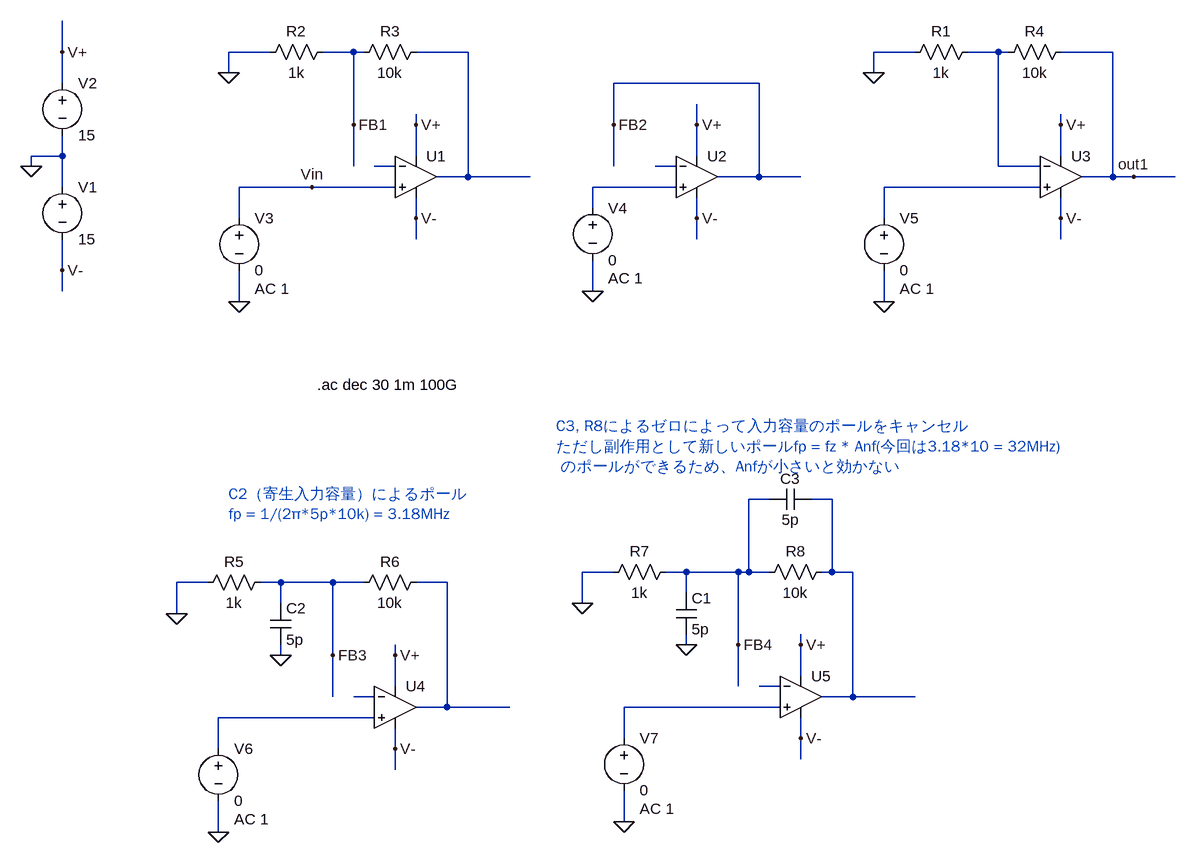
[diagram p0: schematic NonInvAmp.asc]
NonInvAmp.asc, the LTspice schematic file:
Version 4
SHEET 1 1684 1236
WIRE -96 16 -96 -32
WIRE 224 16 160 16
WIRE 352 16 304 16
WIRE 368 16 352 16
WIRE 528 16 448 16
WIRE 1216 16 1152 16
WIRE 1344 16 1296 16
WIRE 1360 16 1344 16
WIRE 1520 16 1440 16
WIRE 160 48 160 16
WIRE 1152 48 1152 16
WIRE -96 64 -96 16
WIRE 976 64 752 64
WIRE 352 128 352 16
WIRE 448 128 448 112
WIRE 752 128 752 64
WIRE 880 128 880 96
WIRE 1440 128 1440 112
WIRE -96 176 -96 144
WIRE -96 176 -144 176
WIRE 448 176 448 128
WIRE 880 176 880 128
WIRE 1440 176 1440 128
WIRE -144 192 -144 176
WIRE 352 192 352 128
WIRE 416 192 384 192
WIRE 752 192 752 128
WIRE 848 192 816 192
WIRE 1344 192 1344 16
WIRE 1408 192 1344 192
WIRE 528 208 528 16
WIRE 528 208 480 208
WIRE 624 208 528 208
WIRE 976 208 976 64
WIRE 976 208 912 208
WIRE 1040 208 976 208
WIRE 1520 208 1520 16
WIRE 1520 208 1472 208
WIRE 1552 208 1520 208
WIRE 1616 208 1552 208
WIRE -96 224 -96 176
WIRE 288 224 176 224
WIRE 416 224 288 224
WIRE 848 224 720 224
WIRE 1408 224 1168 224
WIRE 720 256 720 224
WIRE 176 272 176 224
WIRE 448 272 448 240
WIRE 880 272 880 240
WIRE 1168 272 1168 224
WIRE 1440 272 1440 240
WIRE 448 304 448 272
WIRE 880 304 880 272
WIRE 1440 304 1440 272
WIRE -96 352 -96 304
WIRE -96 384 -96 352
WIRE 720 384 720 336
WIRE 176 400 176 352
WIRE 1168 400 1168 352
WIRE 992 704 960 704
WIRE 1088 704 1056 704
WIRE 752 816 704 816
WIRE 864 816 832 816
WIRE 944 816 864 816
WIRE 960 816 960 704
WIRE 960 816 944 816
WIRE 992 816 960 816
WIRE 1088 816 1088 704
WIRE 1088 816 1072 816
WIRE 1120 816 1088 816
WIRE 128 832 80 832
WIRE 240 832 208 832
WIRE 320 832 240 832
WIRE 368 832 320 832
WIRE 496 832 448 832
WIRE 864 848 864 816
WIRE 240 864 240 832
WIRE 704 864 704 816
WIRE 80 880 80 832
WIRE 864 928 864 912
WIRE 944 928 944 816
WIRE 1040 928 1040 912
WIRE 240 944 240 928
WIRE 320 944 320 832
WIRE 416 944 416 928
WIRE 1040 976 1040 928
WIRE 416 992 416 944
WIRE 944 992 944 928
WIRE 1008 992 976 992
WIRE 320 1008 320 944
WIRE 384 1008 352 1008
WIRE 1120 1008 1120 816
WIRE 1120 1008 1072 1008
WIRE 1216 1008 1120 1008
WIRE 496 1024 496 832
WIRE 496 1024 448 1024
WIRE 592 1024 496 1024
WIRE 1008 1024 768 1024
WIRE 384 1040 144 1040
WIRE 768 1072 768 1024
WIRE 1040 1072 1040 1040
WIRE 144 1088 144 1040
WIRE 416 1088 416 1056
WIRE 1040 1104 1040 1072
WIRE 416 1120 416 1088
WIRE 768 1200 768 1152
WIRE 144 1216 144 1168
FLAG 176 400 0
FLAG -144 192 0
FLAG -96 16 V+
FLAG -96 352 V-
FLAG 448 128 V+
FLAG 448 272 V-
FLAG 160 48 0
FLAG 288 224 Vin
FLAG 720 384 0
FLAG 880 128 V+
FLAG 880 272 V-
FLAG 352 128 FB1
FLAG 752 128 FB2
FLAG 1168 400 0
FLAG 1440 128 V+
FLAG 1440 272 V-
FLAG 1152 48 0
FLAG 1552 208 out1
FLAG 144 1216 0
FLAG 416 944 V+
FLAG 416 1088 V-
FLAG 80 880 0
FLAG 320 944 FB3
FLAG 240 944 0
FLAG 768 1200 0
FLAG 1040 928 V+
FLAG 1040 1072 V-
FLAG 704 864 0
FLAG 944 928 FB4
FLAG 864 928 0
SYMBOL Opamps\\UniversalOpamp2 448 208 R0
SYMATTR InstName U1
SYMBOL voltage -96 208 R0
SYMATTR InstName V1
SYMATTR Value 15
SYMBOL voltage -96 48 R0
WINDOW 123 0 0 Left 2
WINDOW 39 0 0 Left 2
SYMATTR InstName V2
SYMATTR Value 15
SYMBOL voltage 176 256 R0
WINDOW 123 24 124 Left 2
WINDOW 39 0 0 Left 2
SYMATTR Value2 AC 1
SYMATTR InstName V3
SYMATTR Value 0
SYMBOL res 320 0 R90
WINDOW 0 0 56 VBottom 2
WINDOW 3 32 56 VTop 2
SYMATTR InstName R2
SYMATTR Value 1k
SYMBOL res 464 0 R90
WINDOW 0 0 56 VBottom 2
WINDOW 3 32 56 VTop 2
SYMATTR InstName R3
SYMATTR Value 10k
SYMBOL Opamps\\UniversalOpamp2 880 208 R0
SYMATTR InstName U2
SYMBOL voltage 720 240 R0
WINDOW 123 24 124 Left 2
WINDOW 39 0 0 Left 2
SYMATTR Value2 AC 1
SYMATTR InstName V4
SYMATTR Value 0
SYMBOL Opamps\\UniversalOpamp2 1440 208 R0
SYMATTR InstName U3
SYMBOL voltage 1168 256 R0
WINDOW 123 24 124 Left 2
WINDOW 39 0 0 Left 2
SYMATTR Value2 AC 1
SYMATTR InstName V5
SYMATTR Value 0
SYMBOL res 1312 0 R90
WINDOW 0 0 56 VBottom 2
WINDOW 3 32 56 VTop 2
SYMATTR InstName R1
SYMATTR Value 1k
SYMBOL res 1456 0 R90
WINDOW 0 0 56 VBottom 2
WINDOW 3 32 56 VTop 2
SYMATTR InstName R4
SYMATTR Value 10k
SYMBOL Opamps\\UniversalOpamp2 416 1024 R0
SYMATTR InstName U4
SYMBOL voltage 144 1072 R0
WINDOW 123 24 124 Left 2
WINDOW 39 0 0 Left 2
SYMATTR Value2 AC 1
SYMATTR InstName V6
SYMATTR Value 0
SYMBOL res 224 816 R90
WINDOW 0 0 56 VBottom 2
WINDOW 3 32 56 VTop 2
SYMATTR InstName R5
SYMATTR Value 1k
SYMBOL res 464 816 R90
WINDOW 0 0 56 VBottom 2
WINDOW 3 32 56 VTop 2
SYMATTR InstName R6
SYMATTR Value 10k
SYMBOL cap 224 864 R0
SYMATTR InstName C2
SYMATTR Value 5p
SYMBOL Opamps\\UniversalOpamp2 1040 1008 R0
SYMATTR InstName U5
SYMBOL voltage 768 1056 R0
WINDOW 123 24 124 Left 2
WINDOW 39 0 0 Left 2
SYMATTR Value2 AC 1
SYMATTR InstName V7
SYMATTR Value 0
SYMBOL res 848 800 R90
WINDOW 0 0 56 VBottom 2
WINDOW 3 32 56 VTop 2
SYMATTR InstName R7
SYMATTR Value 1k
SYMBOL res 1088 800 R90
WINDOW 0 0 56 VBottom 2
WINDOW 3 32 56 VTop 2
SYMATTR InstName R8
SYMATTR Value 10k
SYMBOL cap 848 848 R0
SYMATTR InstName C1
SYMATTR Value 5p
SYMBOL cap 1056 688 R90
WINDOW 0 0 32 VBottom 2
WINDOW 3 32 32 VTop 2
SYMATTR InstName C3
SYMATTR Value 5p
TEXT 296 528 Left 2 !.ac dec 30 1m 100G
TEXT 160 696 Left 2 ;C2（寄生入力容量）によるポール\nfp = 1/(2π*5p*10k) = 3.18MHz
TEXT 664 592 Left 2 ;C3, R8によるゼロによって入力容量のポールをキャンセル\nただし副作用として新しいポールfp = fz * Anf(今回は3.18*10 = 32MHz)\n のポールができるため、Anfが小さいと効かない

The netlist it stands for:
* NonInvAmp.asc
XU1 Vin N003 V+ V- N001 level.2 Avol=1Meg GBW=10Meg Slew=10Meg ilimit=25m rail=0 Vos=0 phimargin=45 en=0 enk=0 in=0 ink=0 Rin=500Meg  ; pins IN+ IN- V+ V- OUT
V1 0 V- 15
V2 V+ 0 15
V3 Vin 0 0 AC 1
R2 FB1 0 1k
R3 N001 FB1 10k
XU2 N005 N004 V+ V- FB2 level.2 Avol=1Meg GBW=10Meg Slew=10Meg ilimit=25m rail=0 Vos=0 phimargin=45 en=0 enk=0 in=0 ink=0 Rin=500Meg  ; pins IN+ IN- V+ V- OUT
V4 N005 0 0 AC 1
XU3 N006 N002 V+ V- out1 level.2 Avol=1Meg GBW=10Meg Slew=10Meg ilimit=25m rail=0 Vos=0 phimargin=45 en=0 enk=0 in=0 ink=0 Rin=500Meg  ; pins IN+ IN- V+ V- OUT
V5 N006 0 0 AC 1
R1 N002 0 1k
R4 out1 N002 10k
XU4 N012 N010 V+ V- N008 level.2 Avol=1Meg GBW=10Meg Slew=10Meg ilimit=25m rail=0 Vos=0 phimargin=45 en=0 enk=0 in=0 ink=0 Rin=500Meg  ; pins IN+ IN- V+ V- OUT
V6 N012 0 0 AC 1
R5 FB3 0 1k
R6 N008 FB3 10k
C2 FB3 0 5p
XU5 N011 N009 V+ V- N007 level.2 Avol=1Meg GBW=10Meg Slew=10Meg ilimit=25m rail=0 Vos=0 phimargin=45 en=0 enk=0 in=0 ink=0 Rin=500Meg  ; pins IN+ IN- V+ V- OUT
V7 N011 0 0 AC 1
R7 FB4 0 1k
R8 N007 FB4 10k
C1 FB4 0 5p
C3 N007 FB4 5p
.ac dec 30 1m 100G
* C2（寄生入力容量）によるポール
* fp = 1/(2π*5p*10k) = 3.18MHz
* C3, R8によるゼロによって入力容量のポールをキャンセル
* ただし副作用として新しいポールfp = fz * Anf(今回は3.18*10 = 32MHz)
*  のポールができるため、Anfが小さいと効かない
.lib UniversalOpamps2.sub
.backanno
.end

* Results of the author's LTspice run, read from the files saved beside the schematic
* Operating Point, zero values left out:
*   V(v+) = 15 V
*   V(v-) = -15 V
*   I(V2) = -7.492 mA
*   I(V1) = -7.492 mA
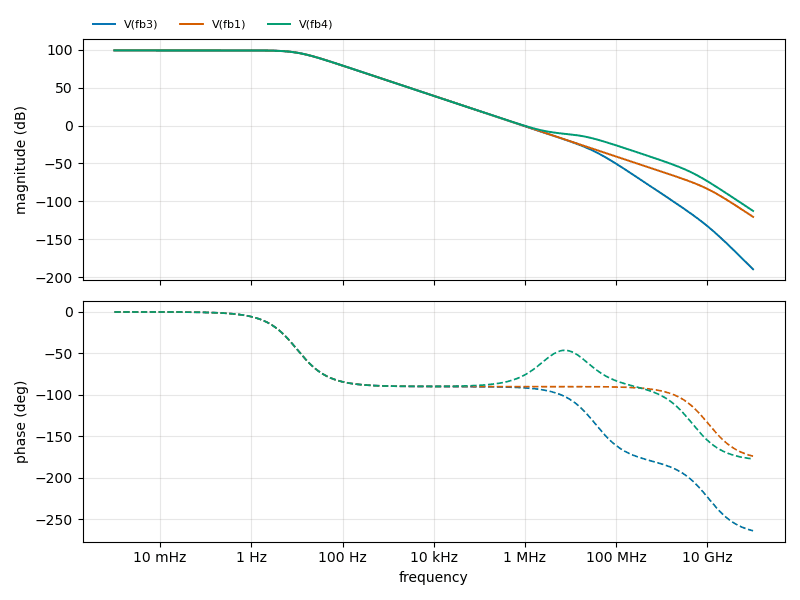
[diagram p1: AC Analysis of NonInvAmp.asc, plotted from the saved traces]
* AC Analysis, 1 run:
*   V(fb3): 99.15 dB at 1 mHz, -189.60 dB at 100 GHz, peak 99.15 dB at 1 mHz, 3 dB below the peak at 10 Hz
*   V(fb1): 99.15 dB at 1 mHz, -120.48 dB at 100 GHz, peak 99.15 dB at 1 mHz, 3 dB below the peak at 10 Hz
*   V(fb4): 99.15 dB at 1 mHz, -112.68 dB at 100 GHz, peak 99.15 dB at 1 mHz, 3 dB below the peak at 10 Hz